# Altium schematic sheet current_sig_amp.SchDoc
size 210 x 148 mm
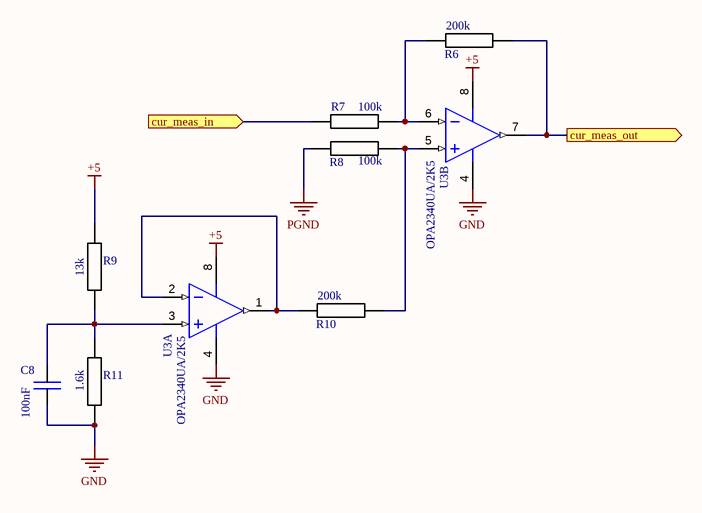
[diagram p0: current_sig_amp.SchDoc]

## Parts
C8  100nF  [0805]
R6  200k  [0805]
R7  100k  [0805]
R8  100k  [0805]
R9  13k  [0805]
R10  200k  [0805]
R11  1.6k  [0805]
U3  OPA2340UA/2K5  [D0008A_M]  (parts A,B of 2)

## Ports
cur_meas_in (in), cur_meas_out (out)

## Nets
+5: R9.1 U3.8(V+)
GND: C8.2 R11.2 U3.4(V-)
PGND: R8.1
cur_meas_in: R7.1 ; port cur_meas_in
cur_meas_out: R6.2 U3.7(OUT_B) ; port cur_meas_out
NetC8_1: C8.1 R9.2 R11.1 U3.3(IN_A+)
NetR6_1: R6.1 R7.2 U3.6(IN_B-)
NetR8_2: R8.2 R10.2 U3.5(IN_B+)
NetR10_1: R10.1 U3.1(OUT_A) U3.2(IN_A-)

## Notes on the sheet
- Project:
- File:
- Date:
- Drawing number:
- Rev:
- Format:
- A5
- Drawn by:
- Laboratory:
- Page
- Sheet:
- of

## Library data of the parts
C8 = cap_smd
R6-R11 = res_smd
U3 = CMP-0272-00789-3: Single-Supply, Rail-to-Rail Operational Amplifier MicroAmplifier(TM) Series, 2.5 to 5.5 V, -40 to 85 degC, 8-pin SOIC (D8), Green (RoHS & no Sb/Br); Manufacturer: Texas Instruments; Sub Family: Low Input Bias Current Amp (<=10pA), Low Offset Voltage Amplifier (<=500uV), Low Supply Voltage Amplifier (<=2.7V), Precision Amplifier; Offset Drift(Typ)(uV/C): 2.5; CMRR(Min)(dB): 80; Vn at 1kHz(Typ)(nV/rtHz): 25; Vio (25C)(Max)(mV): 0.5; Number of Channels: 2; Iq per channel(Max)(mA): 0.95; Slew Rate(Typ)(V/us): 6; Total Supply Voltage(Max)(+5V is 5, +/-5V is 10): 5.5; IIB(Max)(pA): 10; Eco-Plan: Green (RoHS & no Sb/Br); ComponentLink3URL: http://www.ti.com/litv/pdf/msoi002j; PartNumber: OPA2340UA/2K5; PackageReference: D0008A; ComponentLink2URL: http://www.ti.com/general/docs/lit/getliterature.tsp?genericPartNumber=OPA2340&fileType=pdf; Code_JEDEC: MS-012; DatasheetVersion: SBOS073B; ComponentLink1URL: http://www.ti.com/; ComponentLink3Description: Package Specification; ComponentLink2Description: Datasheet; PackageVersion: 4040047-3/M, 06/2011; Mounting Technology: Surface Mount; PackageDescription: 8-Pin Plastic Small Outline, Body 4.9 x 3.9 mm, Pitch 1.27 mm; Total Supply Voltage(Min)(+5V is 5, +/-5V is 10): 2.5; ComponentLink1Description: Manufacturer URL